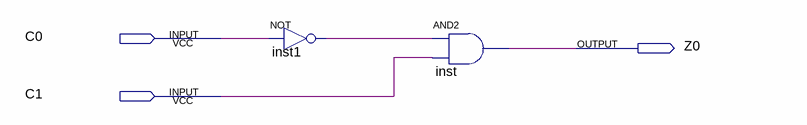
[diagram p0: schematic sheet]
// Quartus schematic cd2.bdf as structural Verilog: 2 symbols, 3 pins
module cd2 (
  input  C0,
  input  C1,
  output Z0
);

  wire inst1_out;

  not inst1 (inst1_out, C0);
  and inst (Z0, inst1_out, C1);
endmodule
